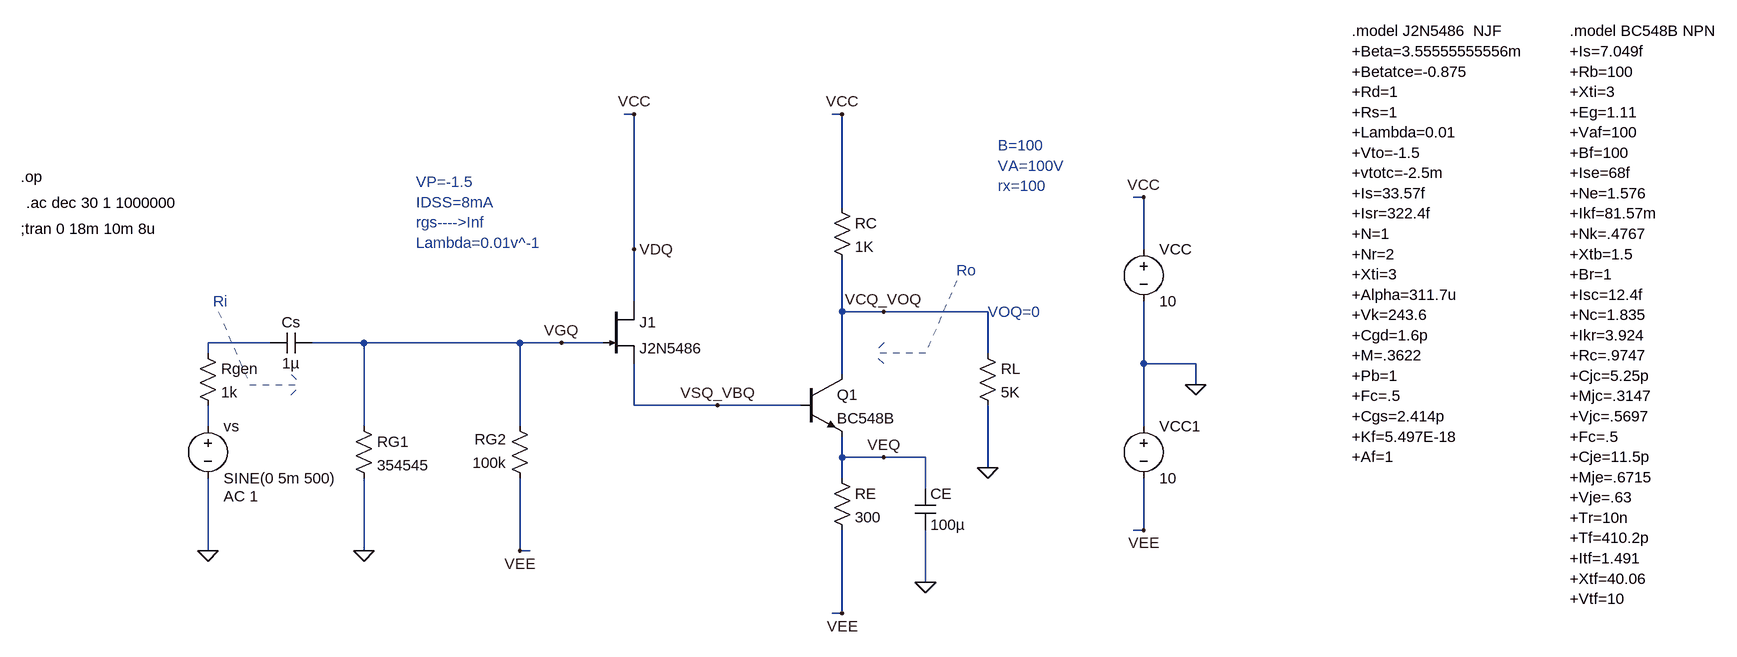
[diagram p0: schematic Parte 2.asc]
Parte 2.asc, the LTspice schematic file:
Version 4
SHEET 1 2708 872
WIRE -32 -48 -48 -48
WIRE 288 -48 272 -48
WIRE 752 80 736 80
WIRE 288 96 288 -48
WIRE -32 160 -32 -48
WIRE 752 160 752 80
WIRE -32 240 -32 160
WIRE 288 256 288 176
WIRE 352 256 288 256
WIRE 512 256 352 256
WIRE -592 304 -688 304
WIRE -448 304 -528 304
WIRE -208 304 -448 304
WIRE -144 304 -208 304
WIRE -80 304 -144 304
WIRE -688 320 -688 304
WIRE 512 320 512 256
WIRE 752 336 752 240
WIRE 832 336 752 336
WIRE 288 352 288 256
WIRE 832 368 832 336
WIRE -32 400 -32 336
WIRE 96 400 -32 400
WIRE 224 400 96 400
WIRE -688 432 -688 400
WIRE -448 432 -448 304
WIRE -208 432 -208 304
WIRE 752 432 752 336
WIRE 288 480 288 448
WIRE 352 480 288 480
WIRE 416 480 352 480
WIRE 512 496 512 400
WIRE 288 512 288 480
WIRE 416 528 416 480
WIRE 752 592 752 512
WIRE 752 592 736 592
WIRE -688 624 -688 512
WIRE -448 624 -448 512
WIRE -208 624 -208 512
WIRE -192 624 -208 624
WIRE 416 672 416 592
WIRE 288 720 288 592
WIRE 288 720 272 720
FLAG -448 624 0
FLAG 752 80 VCC
FLAG -208 624 VEE
FLAG -688 624 0
FLAG 832 368 0
FLAG 752 592 VEE
FLAG -32 -48 VCC
FLAG 288 -48 VCC
FLAG 288 720 VEE
FLAG 512 496 0
FLAG 416 672 0
FLAG -144 304 VGQ
FLAG -32 160 VDQ
FLAG 96 400 VSQ_VBQ
FLAG 352 256 VCQ_VOQ
FLAG 352 480 VEQ
SYMBOL npn 224 352 R0
SYMATTR InstName Q1
SYMATTR Value BC548B
SYMBOL res -464 416 R0
SYMATTR InstName RG1
SYMATTR Value 354545
SYMBOL res -192 528 R180
WINDOW 0 36 76 Left 2
WINDOW 3 36 40 Left 2
SYMATTR InstName RG2
SYMATTR Value 100k
SYMBOL voltage 752 144 R0
WINDOW 123 0 0 Left 0
WINDOW 39 0 0 Left 0
SYMATTR InstName VCC
SYMATTR Value 10
SYMBOL cap -528 288 R90
WINDOW 0 0 32 VBottom 2
WINDOW 3 32 32 VTop 2
SYMATTR InstName Cs
SYMATTR Value 1µ
SYMBOL voltage -688 416 R0
WINDOW 123 24 124 Left 2
WINDOW 39 0 0 Left 0
SYMATTR Value2 AC 1
SYMATTR InstName vs
SYMATTR Value SINE(0 5m 500)
SYMBOL njf -80 240 R0
SYMATTR InstName J1
SYMATTR Value J2N5486
SYMBOL voltage 752 416 R0
WINDOW 123 0 0 Left 0
WINDOW 39 0 0 Left 0
SYMATTR InstName VCC1
SYMATTR Value 10
SYMBOL res 272 80 R0
SYMATTR InstName RC
SYMATTR Value 1K
SYMBOL res 272 496 R0
SYMATTR InstName RE
SYMATTR Value 300
SYMBOL res 496 304 R0
SYMATTR InstName RL
SYMATTR Value 5K
SYMBOL cap 400 528 R0
SYMATTR InstName CE
SYMATTR Value 100µ
SYMBOL res -704 304 R0
SYMATTR InstName Rgen
SYMATTR Value 1k
TEXT 1408 -176 Left 2 !.model BC548B NPN\n+Is=7.049f\n+Rb=100\n+Xti=3\n+Eg=1.11\n+Vaf=100\n+Bf=100\n+Ise=68f\n+Ne=1.576\n+Ikf=81.57m\n+Nk=.4767\n+Xtb=1.5\n+Br=1\n+Isc=12.4f\n+Nc=1.835\n+Ikr=3.924\n+Rc=.9747\n+Cjc=5.25p\n+Mjc=.3147\n+Vjc=.5697\n+Fc=.5\n+Cje=11.5p\n+Mje=.6715\n+Vje=.63\n+Tr=10n\n+Tf=410.2p\n+Itf=1.491\n+Xtf=40.06\n+Vtf=10
TEXT -976 128 Left 2 !;tran 0 18m 10m 8u
TEXT -968 88 Left 2 !.ac dec 30 1 1000000
TEXT -976 48 Left 2 !.op
TEXT 1072 -176 Left 2 !.model J2N5486  NJF\n+Beta=3.55555555556m\n+Betatce=-0.875\n+Rd=1\n+Rs=1\n+Lambda=0.01\n+Vto=-1.5\n+vtotc=-2.5m\n+Is=33.57f\n+Isr=322.4f\n+N=1\n+Nr=2\n+Xti=3\n+Alpha=311.7u\n+Vk=243.6\n+Cgd=1.6p\n+M=.3622\n+Pb=1\n+Fc=.5\n+Cgs=2.414p\n+Kf=5.497E-18\n+Af=1
TEXT -368 56 Left 2 ;VP=-1.5\nIDSS=8mA\nrgs---->Inf\nLambda=0.01v^-1
TEXT 528 0 Left 2 ;B=100\nVA=100V\nrx=100
TEXT 512 256 Left 2 ;VOQ=0
TEXT 464 192 Left 2 ;Ro
TEXT -680 240 Left 2 ;Ri
LINE Normal -624 368 -544 368 2
LINE Normal -560 352 -544 368 2
LINE Normal -560 384 -544 368 2
LINE Normal -672 256 -624 368 2
LINE Normal 416 320 336 320 2
LINE Normal 352 304 336 320 2
LINE Normal 352 336 336 320 2
LINE Normal 464 208 416 320 2

The netlist it stands for:
* Parte 2.asc
Q1 VCQ_VOQ VSQ_VBQ VEQ 0 BC548B
RG1 VGQ 0 354545
RG2 VEE VGQ 100k
VCC VDQ 0 10
Cs VGQ N001 1µ
vs N002 0 SINE(0 5m 500) AC 1
J1 VDQ VGQ VSQ_VBQ J2N5486
VCC1 0 VEE 10
RC VDQ VCQ_VOQ 1K
RE VEQ VEE 300
RL VCQ_VOQ 0 5K
CE VEQ 0 100µ
Rgen N001 N002 1k
.model NPN NPN
.model PNP PNP
.lib standard.bjt
.model NJF NJF
.model PJF PJF
.lib standard.jft
.model BC548B NPN
+Is=7.049f
+Rb=100
+Xti=3
+Eg=1.11
+Vaf=100
+Bf=100
+Ise=68f
+Ne=1.576
+Ikf=81.57m
+Nk=.4767
+Xtb=1.5
+Br=1
+Isc=12.4f
+Nc=1.835
+Ikr=3.924
+Rc=.9747
+Cjc=5.25p
+Mjc=.3147
+Vjc=.5697
+Fc=.5
+Cje=11.5p
+Mje=.6715
+Vje=.63
+Tr=10n
+Tf=410.2p
+Itf=1.491
+Xtf=40.06
+Vtf=10
;tran 0 18m 10m 8u
.ac dec 30 1 1000000
.op
.model J2N5486  NJF
+Beta=3.55555555556m
+Betatce=-0.875
+Rd=1
+Rs=1
+Lambda=0.01
+Vto=-1.5
+vtotc=-2.5m
+Is=33.57f
+Isr=322.4f
+N=1
+Nr=2
+Xti=3
+Alpha=311.7u
+Vk=243.6
+Cgd=1.6p
+M=.3622
+Pb=1
+Fc=.5
+Cgs=2.414p
+Kf=5.497E-18
+Af=1
* VP=-1.5
* IDSS=8mA
* rgs---->Inf
* Lambda=0.01v^-1
* B=100
* VA=100V
* rx=100
* VOQ=0
* Ro
* Ri
.backanno
.end

* Results of the author's LTspice run, read from the files saved beside the schematic
* Operating Point, zero values left out:
*   V(vcq_voq) = 601.4 mV
*   V(vsq_vbq) = -6.455 V
*   V(veq) = -7.187 V
*   V(vgq) = -7.8 V
*   V(vee) = -10 V
*   V(vdq) = 10 V
*   Ic(Q1) = 9.278 mA
*   Ib(Q1) = 98.75 µA
*   Ie(Q1) = -9.377 mA
*   Id(J1) = 98.75 µA
*   Ig(J1) = -20.75 pA
*   Is(J1) = -98.75 µA
*   I(Rl) = 120.3 µA
*   I(Re) = 9.377 mA
*   I(Rc) = 9.399 mA
*   I(Rg2) = -22 µA
*   I(Rg1) = -22 µA
*   I(Vcc1) = -9.399 mA
*   I(Vcc) = -9.497 mA
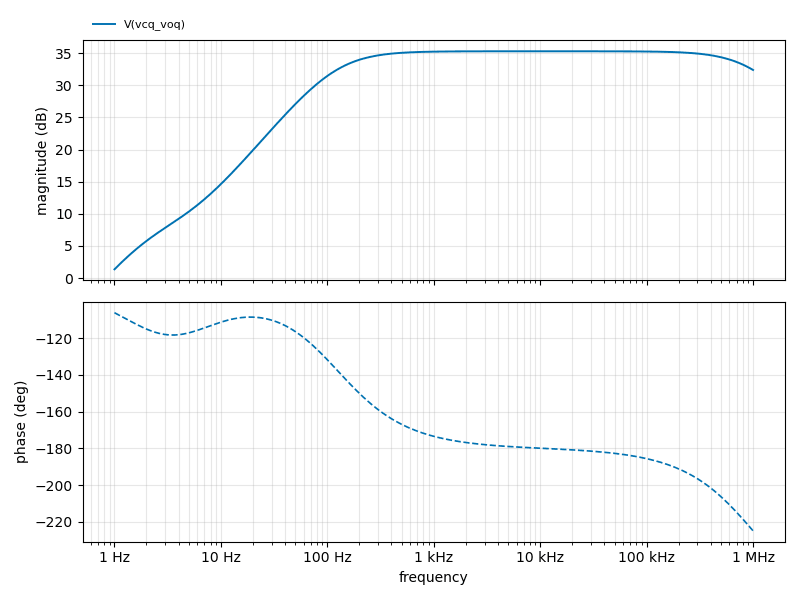
[diagram p1: AC Analysis of Parte 2.asc, plotted from the saved traces]
* AC Analysis, 1 run:
*   V(vcq_voq): 1.36 dB at 1 Hz, 32.40 dB at 1 MHz, peak 35.31 dB at 10.8 kHz, 3 dB below the peak at 119.5 Hz
* From the log:
*   Semiconductor Device Operating Points:
*                           --- Bipolar Transistors ---
*   Name:       q1
*   Model:    bc548b
*   Ib:       9.88e-05
*   Ic:       9.28e-03
*   Vbe:      7.32e-01
*   Vbc:     -7.06e+00
*   Vce:      7.79e+00
*   BetaDC:   9.40e+01
*   Gm:       3.29e-01
*   Rpi:      2.65e+02
*   Rx:       1.00e+02
*   Ro:       1.15e+04
*   Cbe:      1.70e-10
*   Cbc:      2.32e-12
*   Cjs:      0.00e+00
*   BetaAC:   8.72e+01
*   Cbx:      0.00e+00
*   Ft:       3.04e+08
*                           --- JFET Transistors ---
*   Name:      j1
*   Model:   j2n5486
*   Id:      9.88e-05
*   Vgs:    -1.35e+00
*   Vds:     1.65e+01
*   Gm:      1.28e-03
*   Gds:     8.48e-07
*   Cgs:     1.77e-12
*   Cgd:     5.53e-13